# EAGLE design optoswitch (EAGLE 6.6.0)
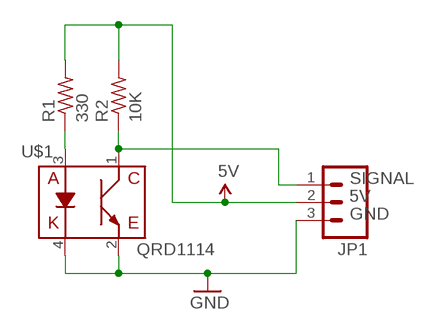
[diagram p0: schematic, sheet 1]

## Parts
JP1  M03POLAR  [MOLEX-1X3]
R1  330  R-US_R2512  [R2512]
R2  10K  R-US_R2512  [R2512]
U$1  QRD1114  [QRD1114]

## Nets
5V: JP1.2 R1.2 R2.2
GND: JP1.3 U$1.2(C) U$1.4(K)
N$1: R1.1 U$1.3(A)
SIGNAL: JP1.1 R2.1 U$1.1(E)

## Library data of the parts
JP1 = SparkFun-Connectors:M03: Header 3 Standard 3-pin 0.1" header. Use with straight break away headers (SKU : PRT-00116), right angle break away headers (PRT-00553), swiss pins (PRT-00743), machine pins (PRT-00117), and female headers (PRT-00115). Molex polarized connector foot print use with SKU : PRT-08232 with associated crimp pins and housings.
R1 R2 = resistor:R-US_: RESISTOR, American symbol
U$1 = SparkFun-Sensors:QRD1114: Reflective object sensor

## Board
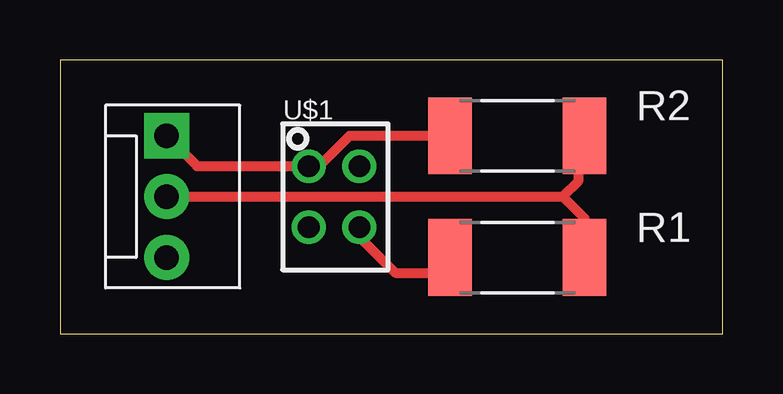
[diagram p1: board, top side]
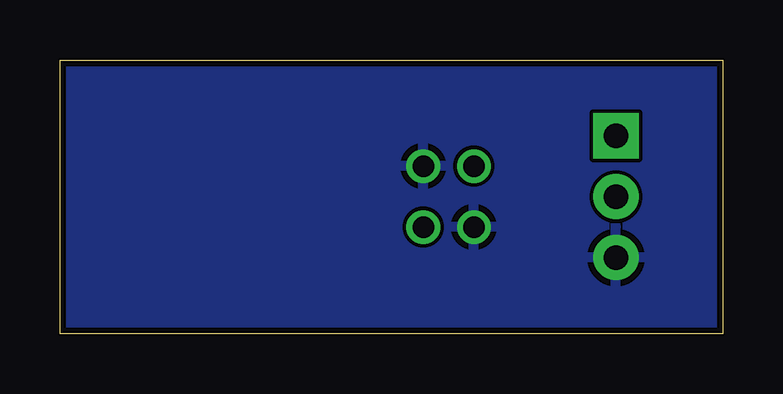
[diagram p2: board, bottom side, seen from below]

Size 27.61 x 11.42 mm. Coordinates in mm from the lower left corner, seen from the top.
Outline: 0,0 27.61,0 27.61,11.42 0,11.42 0,0
Copper layers (1*16): Top 0.035mm / dielectric 1.5mm / Bottom 0.035mm
Design rules "SeeedStudio_2layer_DRU_no_angle_20140221": minimum track width 6mil, minimum drill 12mil, track to track 6mil, track to pad 6mil, pad to pad 6mil, via to via 6mil, smd to smd 0mil, copper to edge 10mil, drill to drill 10mil, minimum pad ring 10mil, minimum via ring 6mil, stop-mask expansion 2mil, vias tented up to drill 100mil, thermal gap 10mil

### Footprints (pad centres in the part's own frame; a part is rotated, then mirrored left to right if it is on the bottom)
MOLEX-1X3 = drill 1.016 pad 1.88 square: 1 0,0 | drill 1.016 pad 1.88: 2 2.54,0; 3 5.08,0
R2512 = smd 1.8 x 3.2: 1 -2.8,0; 2 2.8,0
QRD1114 = drill 0.9: 1 -1.067,1.27; 2 -1.067,-1.27; 3 1.041,-1.27; 4 1.041,1.27

### Placement (x,y rotation side)
JP1  4.45,8.25 270 top
R1  19.05,3.18 0 top
R2  19.05,8.25 0 top
U$1  11.43,5.71 0 top

### Tracks (layer width: path | path; a pad name or v marks a point on that pad's centre or on a via)
5V
  Top 0.406: JP1.2 20.95,5.71 | R2.2 21.59,8 21.59,6.35 20.95,5.71 | R1.2 21.85,4.82 20.95,5.71
GND
  pour Bottom: 0,11.43 0,0 27.94,0 27.94,11.43
N$1
  Top 0.406: U$1.3 12.47,4.04 13.97,2.54 15.62,2.54 R1.1
SIGNAL
  Top 0.406: JP1.1 5.72,6.98 U$1.1 10.8,6.98 12.07,8.25 R2.1